# Altium schematic sheet INS_Visualizer.SchDoc: INS_Visualizer
size A4; Author: Daria Mykhailova; Organization: Kiyv Aviation Institute; Revision: v1; SheetNumber: 1; SheetTotal: 1
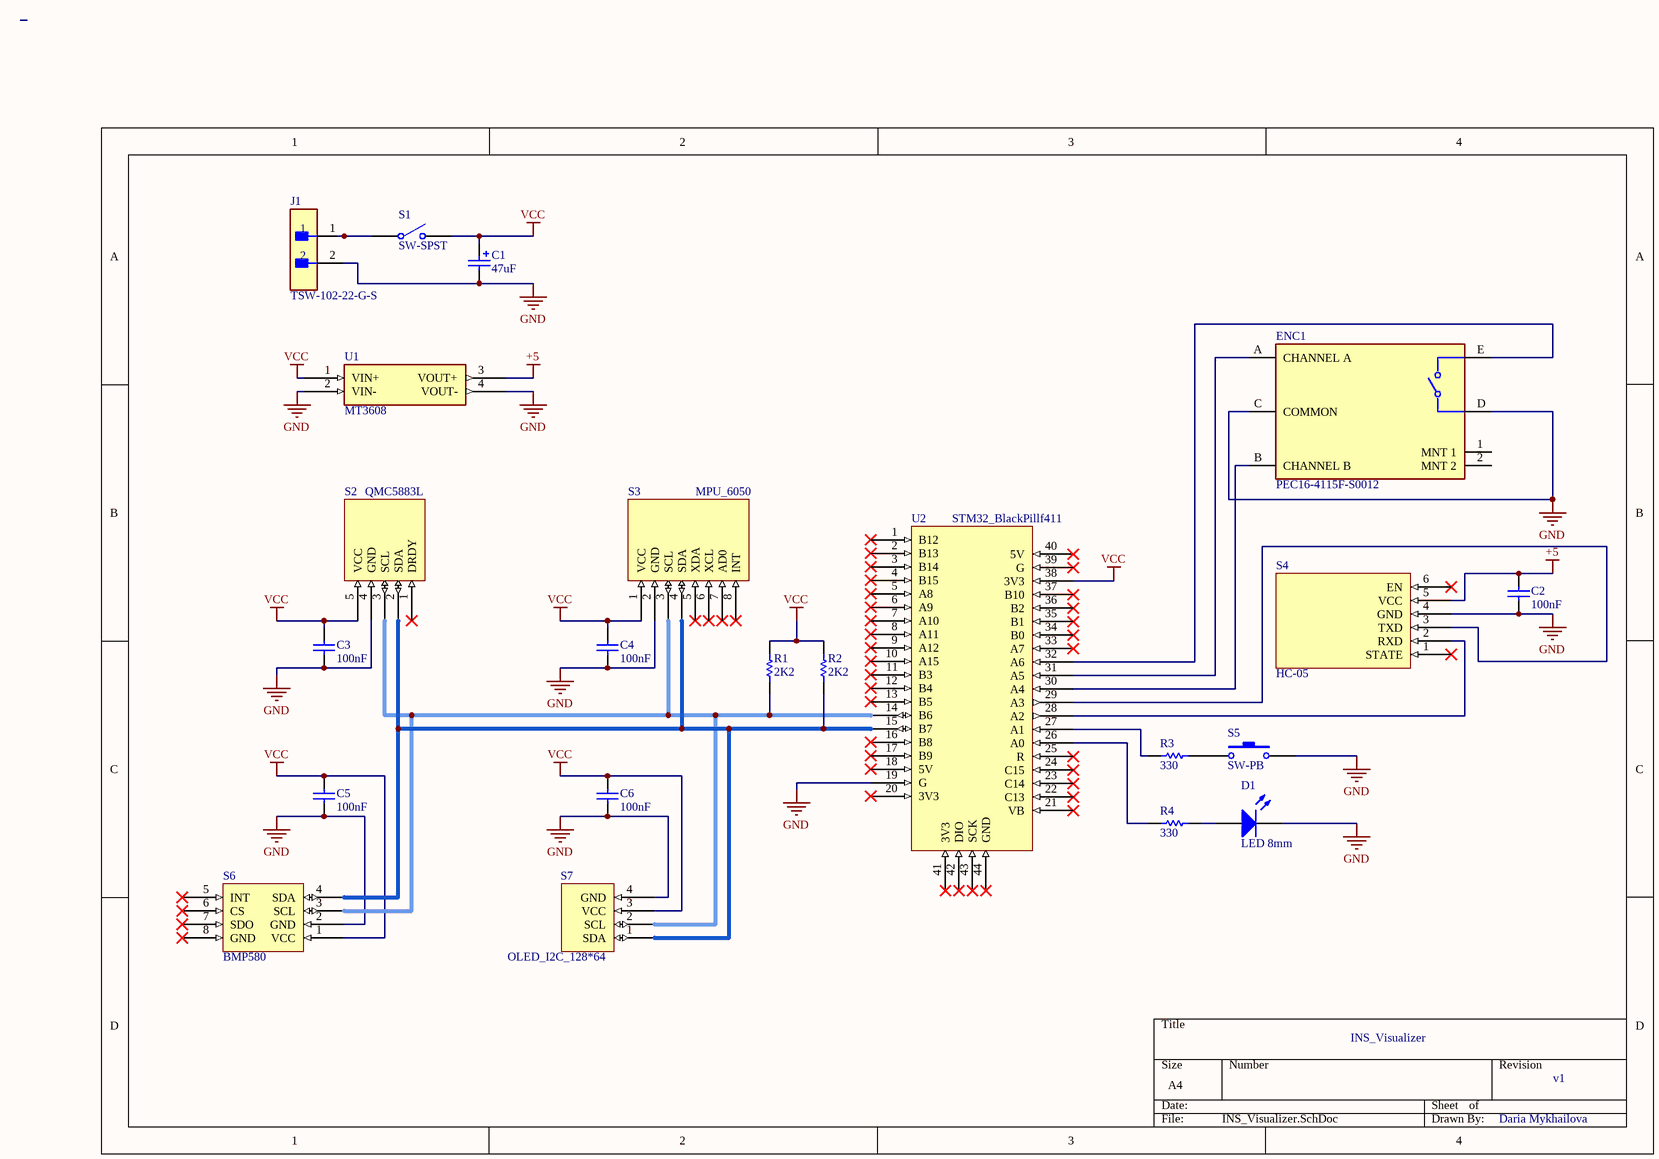
[diagram p0: INS_Visualizer.SchDoc]

## Parts
C1  value 47uF  [Capacitor Pol]  (hidden comment: Capacitor Pol)
C2  value 100nF  [RAD-0.3]  (hidden comment: Capacitor)
C3  value 100nF  [RAD-0.3]  (hidden comment: Capacitor)
C4  value 100nF  [RAD-0.3]  (hidden comment: Capacitor)
C5  value 100nF  [RAD-0.3]  (hidden comment: Capacitor)
C6  value 100nF  [RAD-0.3]  (hidden comment: Capacitor)
D1  LED 8mm  [LED 8mm]
ENC1  PEC16-4115F-S0012  [FP-PEC16-4115F-S0012-MFG]
J1  TSW-102-22-G-S  [FP-TSW-102-22-G-S-MFG]
R1  value 2K2  [AXIAL-0.3]  (hidden comment: Resistor)
R2  value 2K2  [AXIAL-0.3]  (hidden comment: Resistor)
R3  value 330  [AXIAL-0.3]  (hidden comment: Resistor)
R4  value 330  [AXIAL-0.3]  (hidden comment: Resistor)
S1  SW-SPST  [SPST-2]
S2  QMC5883L  [QMC5883L]
S3  MPU_6050  [MPU6050_HDR1X8]
S4  HC-05  [HC-05_HDR1x6H]
S5  SW-PB  [SPST-2]
S6  BMP580  [BMP580_HDR1x4]
S7  OLED_I2C_128*64  [OLED_HDR1x4]
U1  MT3608  [MT3608]
U2  STM32_BlackPillf411  [STM32_HDR2x20]

## Nets
+5: C2.2 S4.5(VCC) U1.3(VOUT+)
GND: C1.2 C2.1 C3.1 C4.1 C5.1 C6.1 D1.2 ENC1.C(COMMON) ENC1.D J1.2 S2.4(GND) S3.2(GND) S4.4(GND) S5.2 S6.2(GND) S7.4(GND) U1.2(VIN-) U1.4(VOUT-) U2.19(G)
VCC: C1.1 C3.2 C4.2 C5.2 C6.2 R1.2 R2.2 S1.2(NO) S2.5(VCC) S3.1(VCC) S6.1(VCC) S7.3(VCC) U1.1(VIN+) U2.38(3V3)
NetD1_1: D1.1 R4.1
NetENC1_A: ENC1.A(CHANNEL_A) U2.31(A5)
NetENC1_B: ENC1.B(CHANNEL_B) U2.30(A4)
NetENC1_E: ENC1.E U2.32(A6)
NetJ1_1: J1.1 S1.1(COMMON)
NetR1_1: R1.1 S2.3(SCL) S3.3(SCL) S6.3(SCL) S7.2(SCL) U2.14(B6)
NetR2_1: R2.1 S2.2(SDA) S3.4(SDA) S6.4(SDA) S7.1(SDA) U2.15(B7)
NetR3_1: R3.1 S5.1
NetR3_2: R3.2 U2.27(A1)
NetR4_2: R4.2 U2.26(A0)
NetS4_2: S4.2(RXD) U2.28(A2)
NetS4_3: S4.3(TXD) U2.29(A3)

Not connected (* = marked no-connect by the designer): ENC1 1(MNT_1) 2(MNT_2); S2 1(DRDY)*; S3 5(XDA)* 6(XCL)* 7(AD0)* 8(INT)*; S4 1(STATE)* 6(EN)*; S6 5(INT)* 6(CS)* 7(SDO)* 8(GND)*; U2 1(B12)* 2(B13)* 3(B14)* 4(B15)* 5(A8)* 6(A9)* 7(A10)* 8(A11)* 9(A12)* 10(A15)* 11(B3)* 12(B4)* 13(B5)* 16(B8)* 17(B9)* 18(5V)* 20(3V3)* 21(VB)* 22(C13)* 23(C14)* 24(C15)* 25(R)* 33(A7)* 34(B0)* 35(B1)* 36(B2)* 37(B10)* 39(G)* 40(5V)* 41(3V3)* 42(DIO)* 43(SCK)* 44(GND)*

## Library data of the parts
C1 = Capacitor Pol: Polarized Capacitor (Radial); Published: 8-Jun-2000; LatestRevisionDate: 17-Jul-2002; LatestRevisionNote: Re-released for DXP Platform.; PackageReference: RB7.6-15; Publisher: Altium Limited; PackageDescription: Polarized Capacitor (Radial); 2 Leads
ENC1 = CMP-07421-000056-1: ROTARY ENCODER MECHANICAL 12PPR; Pulses per Revolution: 12; Built in Switch: Yes; Output Type: Quadrature; Number of Channels: 2; Operating Supply Voltage: 5V; Min Operating Temperature: -30°C; Package Quantity: 50; Length: 23mm; Height: 17.3mm; Mount: Through Hole; Termination: PC Pin; Encoder Type: Mechanical; Max Operating Temperature: 70°C; Orientation: Vertical; RoHS Compliant: Yes; Series: PEC16; Width: 16mm; Detent: Yes
J1 = CMP-02766-000117-1: CONN HEADER VERT 2POS 2.54MM; Max Voltage Rating (AC): 550V; Gender: Male; Max Current Rating: 7.6A; Number of Contacts: 2; Housing Color: Black; Max Operating Temperature: 125°C; Orientation: Straight; Depth: 2.54mm; Pitch: 2.54mm; Housing Material: Polyester; Packaging: Bulk; Termination: Solder; Contact Plating: Gold; Length: 5.08mm; Number of Rows: 1; Radiation Hardening: No; Min Operating Temperature: -55°C; REACH SVHC: No SVHC; Contact Material: Bronze
S1 = SW-SPST: Single-Pole, Single-Throw Switch; Published: 24-Mar-1999; LatestRevisionDate: 17-Jul-2002; LatestRevisionNote: Re-released for DXP Platform.; PackageReference: SPST-2; Publisher: Altium Limited; PackageDescription: Switch; 2 Leads
S5 = SW-PB: Switch; Published: 24-Mar-1999; LatestRevisionDate: 17-Jul-2002; LatestRevisionNote: Re-released for DXP Platform.; PackageReference: SPST-2; Publisher: Altium Limited; PackageDescription: Switch; 2 Leads
C2-C6 = Capacitor: Published: 8-Jun-2000; LatestRevisionDate: 17-Jul-2002; LatestRevisionNote: Re-released for DXP Platform.; PackageReference: RAD-0.3; Publisher: Altium Limited; PackageDescription: Radial Cap, Thru-Hole; 2 Leads; 0.3 in Pin Spacing
R1-R4 = Resistor: Published: 8-Jun-2000; LatestRevisionDate: 17-Jul-2002; LatestRevisionNote: Re-released for DXP Platform.; PackageReference: AXIAL-0.3; Publisher: Altium Limited; PackageDescription: Axial Device, Thru-Hole; 2 Leads; 0.3 in Pin Spacing